# Altium schematic sheet tsmp-resistors.SchDoc: tsmp-resistors
size A4; Date: 05.10.2017; CheckedBy: UNCHECKED; Author: Leon Loeser; Organization: Baltic Racing; Address1: Zur Schwedenschanze 15; Address2: Haus 18; Address3: 18435 Stralsund; Revision: 1.0; SheetNumber: 3; SheetTotal: 3; Rules: EV4.7.6; ProjectName: Projekt
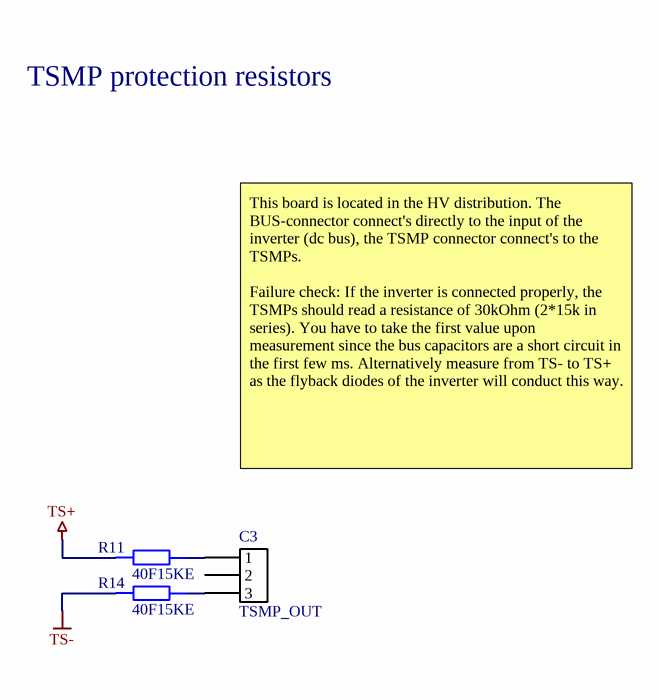
[diagram p0: tsmp-resistors.SchDoc]

## Parts
C3  TSMP_OUT  [43650-0309]
R11  40F15KE  [OHMITE_40_SERIES]
R14  40F15KE  [OHMITE_40_SERIES]

## Nets
TS+: R11.1
TS-: R14.1
NetC3_1: C3.1 R11.2
NetC3_3: C3.3 R14.2

Not connected (* = marked no-connect by the designer): C3 2

## Notes on the sheet
- TSMP protection resistors
- This board is located in the HV distribution. The BUS-connector connect's directly to the input of the inverter (dc bus), the TSMP connector connect's to the TSMPs.
  Failure check: If the inverter is connected properly, the TSMPs should read a resistance of 30kOhm (2*15k in series). You have to take the first value upon measurement since the bus capacitors are a short circuit in the first few ms. Alternatively measure from TS- to TS+ as the flyback diodes of the inverter will conduct this way.
- Title:
- Projekt:
- Revision:
- Author:
- Rules:
- Checked by:
- Sheet
- of
- Size:
- A4
- Date:
- Time:

## Library data of the parts
C3 = MicroFit3.0 3-Pin: Molex Micro-Fit 3.0 3-Pin / 600V / 8.5A
R11 R14 = 40F15KE: Wirewound Resistors 10watt 15K 1% Axial; Manufacturer: Ohmite; Power Rating: 10W; Temperature Coefficient: 20ppm/°C; Supplier 1: Mouser; Manufacturer Part Number: 40F15KE; RoHS: Yes; Category: Through-Hole Resistors; Stock 1: 619; Pricing 1: 1=2,89000, 10=2,61000, 50=2,14000, 100=2,06000, 1000=1,35000, 10000=1,32000 (USD); Mount: Through Hole; Case/Package: Axial; Tolerance: 1%; Resistance: 15k; Packaging: Bulk; Package Quantity: 25; Resistor Type: Wirewound; Number of Terminations: 2; Termination: Axial; Max Power Dissipation: 10W; Series: Ohmicone® 40; Length: 1.902inch; RoHS Compliant: Yes; Supplier Part Number 1: 588-40F15KE; ComponentLink4Description: Datasheet; ComponentLink4URL: https://www.ohmite.com/assets/docs/res_40.pdf; ComponentLink5Description: Product Page; ComponentLink5URL: https://www.ohmite.com/40-series